# Altium schematic sheet mcu core.SchDoc
size A4
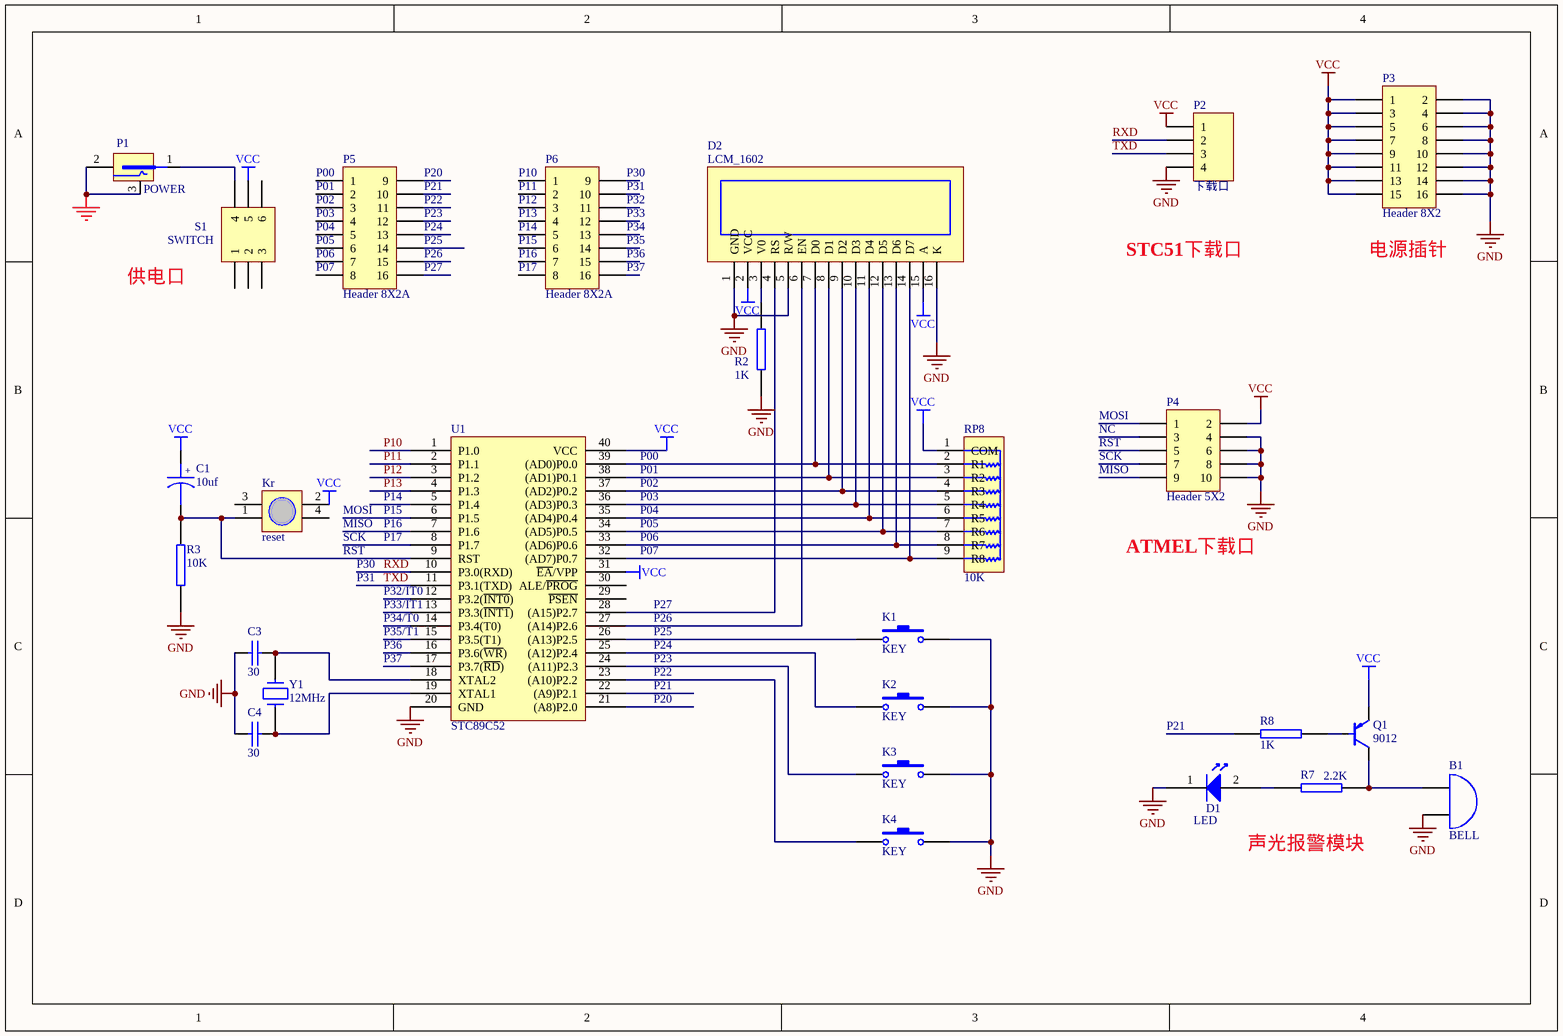
[diagram p0: mcu core.SchDoc]

## Parts
B1  BELL  [bell]
C1  10uf  [C4*7]
C3  30  [CAP-2.54]
C4  30  [CAP-2.54]
D1  LED  [LED5MM-RED]
D2  LCM_1602  [HDR1X16]
K1  KEY  [SW-0606]
K2  KEY  [SW-0606]
K3  KEY  [SW-0606]
K4  KEY  [SW-0606]
Kr  reset  [SW-0606]
P1  POWER  [DC002]
P2  下载口  [HDR1X4]
P3  Header 8X2  [HDR2X8]
P4  Header 5X2  [HDR2X5]
P5  Header 8X2A  [HDR2X8_CEN]
P6  Header 8X2A  [HDR2X8_CEN]
Q1  9012  [TO-92A]
R2  1K  [1/4W]
R3  10K  [1/4W]
R7  2.2K  [1/4W]
R8  1K  [1/4W]
RP8  10K  [R-9PIN]
S1  SWITCH  [SW-8X8X8]
U1  STC89C52  [DIP40]
Y1  12MHz  [XTAL-49/S_N]

## Nets
GND: B1.2 C3.2 C4.2 D1.1 D2.1(GND) D2.5(R/W) D2.16(K) K1.2 K2.2 K3.2 K4.2 P1.2 P1.3 P2.4 P3.2 P3.4 P3.6 P3.8 P3.10 P3.12 P3.14 P3.16 P4.4 P4.6 P4.8 P4.10 R2.1 R3.1 U1.20(GND)
VCC: C1.2 D2.2(VCC) D2.15(A) Kr.2 P2.1 P3.1 P3.3 P3.5 P3.7 P3.9 P3.11 P3.13 P3.15 P4.2 Q1.1(e) RP8.1(COM) S1.5 U1.31(~{EA}/VPP) U1.40(VCC)
MISO: P4.9 P6.7 U1.7(P1.6)  [also labelled P16]
MOSI: P4.1 P6.6 U1.6(P1.5)  [also labelled P15]
NC: P4.3
P00: D2.7(D0) P5.1 RP8.2(R1) U1.39((AD0)P0.0)
P01: D2.8(D1) P5.2 RP8.3(R2) U1.38((AD1)P0.1)
P02: D2.9(D2) P5.3 RP8.4(R3) U1.37((AD2)P0.2)
P03: D2.10(D3) P5.4 RP8.5(R4) U1.36((AD3)P0.3)
P04: D2.11(D4) P5.5 RP8.6(R5) U1.35((AD4)P0.4)
P05: D2.12(D5) P5.6 RP8.7(R6) U1.34((AD5)P0.5)
P06: D2.13(D6) P5.7 RP8.8(R7) U1.33((AD6)P0.6)
P07: D2.14(D7) P5.8 RP8.9(R8) U1.32((AD7)P0.7)
P10: P6.1 U1.1(P1.0)
P11: P6.2 U1.2(P1.1)
P12: P6.3 U1.3(P1.2)
P13: P6.4 U1.4(P1.3)
P14: P6.5 U1.5(P1.4)
P17: P4.7 P6.8 U1.8(P1.7)  [also labelled SCK]
P20: P5.9 U1.21((A8)P2.0)
P21: P5.10 R8.2 U1.22((A9)P2.1)
P22: K4.1 P5.11 U1.23((A10)P2.2)
P23: K3.1 P5.12 U1.24((A11)P2.3)
P24: K2.1 P5.13 U1.25((A12)P2.4)
P25: K1.1 P5.14 U1.26((A13)P2.5)
P26: D2.6(EN) P5.15 U1.27((A14)P2.6)
P27: D2.4(RS) P5.16 U1.28((A15)P2.7)
P30: P2.2 P6.9 U1.10(P3.0(RXD))  [also labelled RXD]
P31: P2.3 P6.10 U1.11(P3.1(TXD))  [also labelled TXD]
P32: P6.11
P32/IT0: U1.12(P3.2(~{INT0}))
P33: P6.12
P33/IT1: U1.13(P3.3(~{INT1}))
P34: P6.13
P34/T0: U1.14(P3.4(T0))
P35: P6.14
P35/T1: U1.15(P3.5(T1))
P36: P6.15 U1.16(P3.6(~{WR}))
P37: P6.16 U1.17(P3.7(~{RD}))
RST: C1.1 Kr.1 P4.5 R3.2 U1.9(RST)
NetB1_1: B1.1 Q1.3(c) R7.1
NetC3_1: C3.1 U1.18(XTAL2) Y1.1
NetC4_1: C4.1 U1.19(XTAL1) Y1.2
NetD1_2: D1.2 R7.2
NetD2_3: D2.3(V0) R2.2
NetP1_1: P1.1 S1.4
NetQ1_2: Q1.2(b) R8.1

Not connected (* = marked no-connect by the designer): Kr 3 4; S1 1 2 3 6; U1 29(~{PSEN}) 30(ALE/~{PROG})

## Notes on the sheet
- 供电口
- STC51下载口
- (near P3) 电源插针
- ATMEL下载口
- 声光报警模块
- (in symbol 电解电容) +

## Library data of the parts
C1 = 电解电容: Capacitor
C3 C4 = CAP: Capacitor
D1 = LED5
D2 = LCM1602
Kr = KEY
P2 = Header 4H: Header, 4-Pin, Right Angle; LatestRevisionDate: 17-Jul-2002; LatestRevisionNote: Re-released for DXP Platform.; Publisher: Altium Limited
P3 = Header 8X2: Header, 8-Pin, Dual row; LatestRevisionDate: 17-Jul-2002; LatestRevisionNote: Re-released for DXP Platform.; Publisher: Altium Limited
P4 = Header 5X2: Header, 5-Pin, Dual row; LatestRevisionDate: 17-Jul-2002; LatestRevisionNote: Re-released for DXP Platform.; Publisher: Altium Limited
P5 P6 = Header 8X2A: Header, 8-Pin, Dual row; LatestRevisionDate: 17-Jul-2002; LatestRevisionNote: Re-released for DXP Platform.; Publisher: Altium Limited
Q1 = PNP
R2 R3 R7 R8 = RES2
RP8 = RP8
S1 = Header 3X2A: Header, 3-Pin, Dual row; LatestRevisionDate: 17-Jul-2002; LatestRevisionNote: Re-released for DXP Platform.; Publisher: Altium Limited
U1 = AT89C51
Y1 = CRYSTAL
K1-K4 = KEY: Published: 24-Mar-1999; LatestRevisionDate: 17-Jul-2002; LatestRevisionNote: Re-released for DXP Platform.; PackageReference: SPST-2; Publisher: Altium Limited